# Altium project maxout_conn.PrjPcb
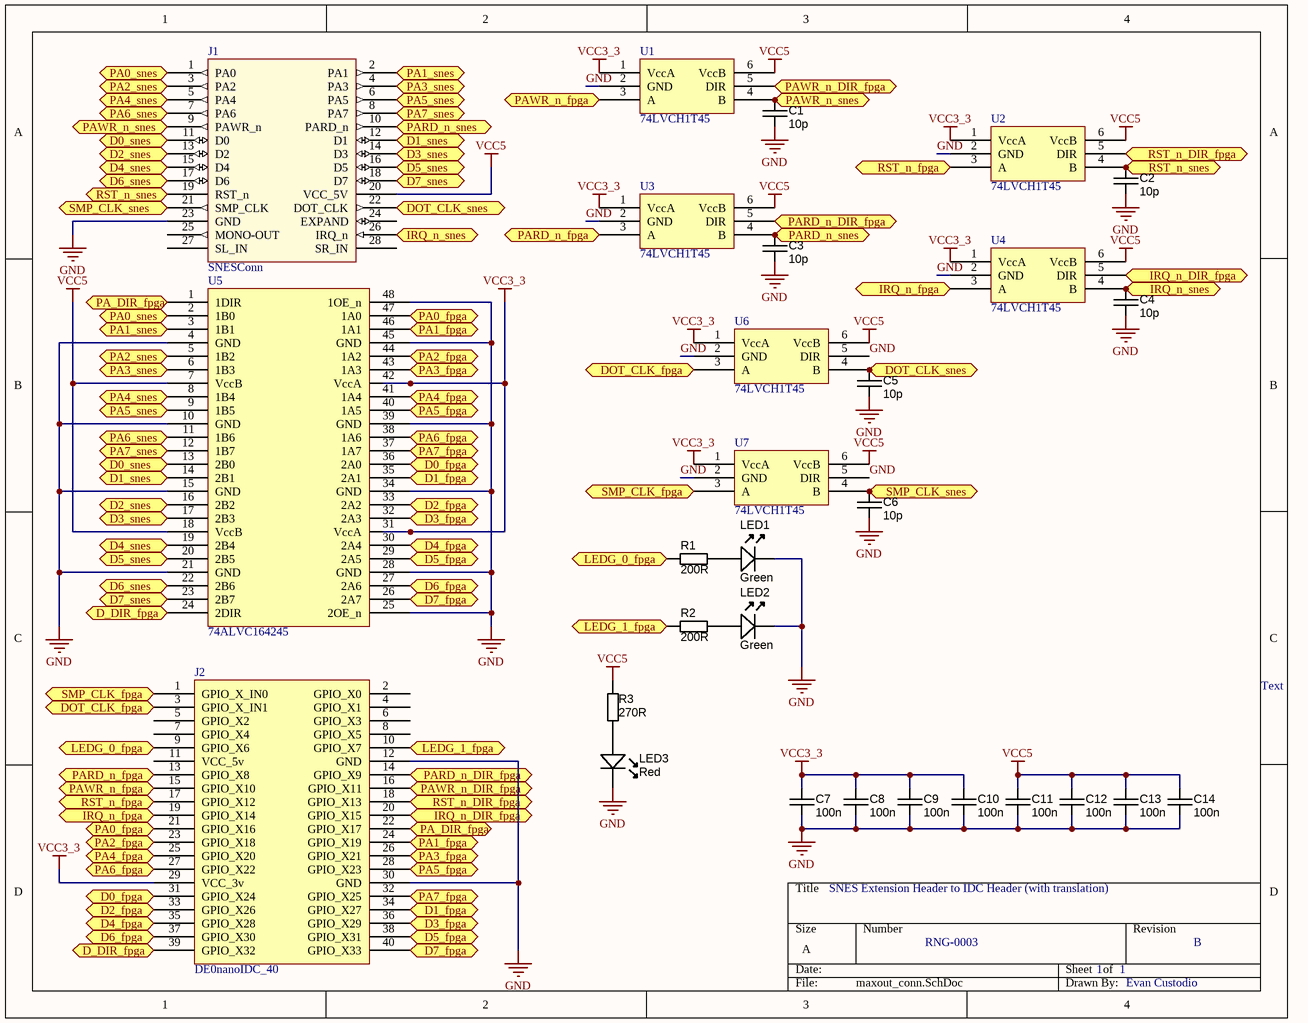
[diagram p0: maxout_conn.SchDoc]
1 sheet, 30 parts. Net scope: flat (ports and power ports of the same name join across sheets).
Board file: maxout_conn.PcbDoc

## Sheet maxout_conn.SchDoc: SNES Extension Header to IDC Header (with translation)
size A; DrawnBy: Evan Custodio; Engineer: Evan Custodio; DocumentNumber: RNG-0003; Revision: B; SheetNumber: 1; SheetTotal: 1

### Parts
?  RNGD_logo  (value not drawn)
C1  10p  [CAPC1608X90N]
C2  10p  [CAPC1608X90N]
C3  10p  [CAPC1608X90N]
C4  10p  [CAPC1608X90N]
C5  10p  [CAPC1608X90N]
C6  10p  [CAPC1608X90N]
C7  value 100n  [CAPC1608X90N]  (hidden comment: approved sub OK)
C8  value 100n  [CAPC1608X90N]  (hidden comment: approved sub OK)
C9  value 100n  [CAPC1608X90N]  (hidden comment: approved sub OK)
C10  value 100n  [CAPC1608X90N]  (hidden comment: approved sub OK)
C11  value 100n  [CAPC1608X90N]  (hidden comment: approved sub OK)
C12  value 100n  [CAPC1608X90N]  (hidden comment: approved sub OK)
C13  value 100n  [CAPC1608X90N]  (hidden comment: approved sub OK)
C14  value 100n  [CAPC1608X90N]  (hidden comment: approved sub OK)
J1  SNESConn  [SNES-MEC2-CONN]
J2  DE0nanoIDC_40  [SNESConnIDC_40]
LED1  Green  [LED-0603-GREEN]
LED2  Green  [LED-0603-GREEN]
LED3  Red  [LED-0603-RED]
R1  value 200R  [RESC1608X55N]  (hidden comment: Thick Film)
R2  value 200R  [RESC1608X55N]  (hidden comment: Thick Film)
R3  value 270R  [RESC1608X55N]  (hidden comment: Thick Film)
U1  74LVCH1T45  [SOT363]
U2  74LVCH1T45  [SOT363]
U3  74LVCH1T45  [SOT363]
U4  74LVCH1T45  [SOT363]
U5  74ALVC164245  [SSOP48]
U6  74LVCH1T45  [SOT363]
U7  74LVCH1T45  [SOT363]

### Ports
D0_fpga, D0_snes, D1_fpga, D1_snes, D2_fpga, D2_snes, D3_fpga, D3_snes, D4_fpga, D4_snes, D5_fpga, D5_snes, D6_fpga, D6_snes, D7_fpga, D7_snes, D_DIR_fpga, DOT_CLK_fpga, DOT_CLK_snes, IRQ_n_DIR_fpga, IRQ_n_fpga, IRQ_n_snes, LEDG_0_fpga, LEDG_1_fpga, PA0_fpga, PA0_snes, PA1_fpga, PA1_snes, PA2_fpga, PA2_snes, PA3_fpga, PA3_snes, PA4_fpga, PA4_snes, PA5_fpga, PA5_snes, PA6_fpga, PA6_snes, PA7_fpga, PA7_snes, PA_DIR_fpga, PARD_n_DIR_fpga, PARD_n_fpga, PARD_n_snes, PAWR_n_DIR_fpga, PAWR_n_fpga, PAWR_n_snes, RST_n_DIR_fpga, RST_n_fpga, RST_n_snes, SMP_CLK_fpga, SMP_CLK_snes

### Nets
GND: C1.2 C2.2 C3.2 C4.2 C5.2 C6.2 C7.2 C8.2 C9.2 C10.2 C11.2 C12.2 C13.2 C14.2 J1.23(GND) J2.12(GND) J2.30(GND) LED1.K LED2.K LED3.K U1.2(GND) U2.2(GND) U3.2(GND) U4.2(GND) U5.4(GND) U5.10(GND) U5.15(GND) U5.21(GND) U5.25(2OE_n) U5.28(GND) U5.34(GND) U5.39(GND) U5.45(GND) U5.48(1OE_n) U6.2(GND) U6.5(DIR) U7.2(GND) U7.5(DIR)
VCC3_3: C7.1 C8.1 C9.1 C10.1 J2.29(VCC_3v) U1.1(VccA) U2.1(VccA) U3.1(VccA) U4.1(VccA) U5.31(VccA) U5.42(VccA) U6.1(VccA) U7.1(VccA)
VCC5: C11.1 C12.1 C13.1 C14.1 J1.20(VCC_5V) R3.1 U1.6(VccB) U2.6(VccB) U3.6(VccB) U4.6(VccB) U5.7(VccB) U5.18(VccB) U6.6(VccB) U7.6(VccB)
NetC1_1: C1.1 J1.9(PAWR_n) U1.4(B) ; port PAWR_n_snes
NetC2_1: C2.1 J1.19(RST_n) U2.4(B) ; port RST_n_snes
NetC3_1: C3.1 J1.10(PARD_n) U3.4(B) ; port PARD_n_snes
NetC4_1: C4.1 J1.26(IRQ_n) U4.4(B) ; port IRQ_n_snes
NetC5_1: C5.1 J1.22(DOT_CLK) U6.4(B) ; port DOT_CLK_snes
NetC6_1: C6.1 J1.21(SMP_CLK) U7.4(B) ; port SMP_CLK_snes
NetJ1_1: J1.1(PA0) U5.2(1B0) ; port PA0_snes
NetJ1_2: J1.2(PA1) U5.3(1B1) ; port PA1_snes
NetJ1_3: J1.3(PA2) U5.5(1B2) ; port PA2_snes
NetJ1_4: J1.4(PA3) U5.6(1B3) ; port PA3_snes
NetJ1_5: J1.5(PA4) U5.8(1B4) ; port PA4_snes
NetJ1_6: J1.6(PA5) U5.9(1B5) ; port PA5_snes
NetJ1_7: J1.7(PA6) U5.11(1B6) ; port PA6_snes
NetJ1_8: J1.8(PA7) U5.12(1B7) ; port PA7_snes
NetJ1_11: J1.11(D0) U5.13(2B0) ; port D0_snes
NetJ1_12: J1.12(D1) U5.14(2B1) ; port D1_snes
NetJ1_13: J1.13(D2) U5.16(2B2) ; port D2_snes
NetJ1_14: J1.14(D3) U5.17(2B3) ; port D3_snes
NetJ1_15: J1.15(D4) U5.19(2B4) ; port D4_snes
NetJ1_16: J1.16(D5) U5.20(2B5) ; port D5_snes
NetJ1_17: J1.17(D6) U5.22(2B6) ; port D6_snes
NetJ1_18: J1.18(D7) U5.23(2B7) ; port D7_snes
NetJ2_1: J2.1(GPIO_X_IN0) U7.3(A) ; port SMP_CLK_fpga
NetJ2_3: J2.3(GPIO_X_IN1) U6.3(A) ; port DOT_CLK_fpga
NetJ2_9: J2.9(GPIO_X6) R1.1 ; port LEDG_0_fpga
NetJ2_10: J2.10(GPIO_X7) R2.1 ; port LEDG_1_fpga
NetJ2_13: J2.13(GPIO_X8) U3.3(A) ; port PARD_n_fpga
NetJ2_14: J2.14(GPIO_X9) U3.5(DIR) ; port PARD_n_DIR_fpga
NetJ2_15: J2.15(GPIO_X10) U1.3(A) ; port PAWR_n_fpga
NetJ2_16: J2.16(GPIO_X11) U1.5(DIR) ; port PAWR_n_DIR_fpga
NetJ2_17: J2.17(GPIO_X12) U2.3(A) ; port RST_n_fpga
NetJ2_18: J2.18(GPIO_X13) U2.5(DIR) ; port RST_n_DIR_fpga
NetJ2_19: J2.19(GPIO_X14) U4.3(A) ; port IRQ_n_fpga
NetJ2_20: J2.20(GPIO_X15) U4.5(DIR) ; port IRQ_n_DIR_fpga
NetJ2_21: J2.21(GPIO_X16) U5.47(1A0) ; port PA0_fpga
NetJ2_22: J2.22(GPIO_X17) U5.1(1DIR) ; port PA_DIR_fpga
NetJ2_23: J2.23(GPIO_X18) U5.44(1A2) ; port PA2_fpga
NetJ2_24: J2.24(GPIO_X19) U5.46(1A1) ; port PA1_fpga
NetJ2_25: J2.25(GPIO_X20) U5.41(1A4) ; port PA4_fpga
NetJ2_26: J2.26(GPIO_X21) U5.43(1A3) ; port PA3_fpga
NetJ2_27: J2.27(GPIO_X22) U5.38(1A6) ; port PA6_fpga
NetJ2_28: J2.28(GPIO_X23) U5.40(1A5) ; port PA5_fpga
NetJ2_31: J2.31(GPIO_X24) U5.36(2A0) ; port D0_fpga
NetJ2_32: J2.32(GPIO_X25) U5.37(1A7) ; port PA7_fpga
NetJ2_33: J2.33(GPIO_X26) U5.33(2A2) ; port D2_fpga
NetJ2_34: J2.34(GPIO_X27) U5.35(2A1) ; port D1_fpga
NetJ2_35: J2.35(GPIO_X28) U5.30(2A4) ; port D4_fpga
NetJ2_36: J2.36(GPIO_X29) U5.32(2A3) ; port D3_fpga
NetJ2_37: J2.37(GPIO_X30) U5.27(2A6) ; port D6_fpga
NetJ2_38: J2.38(GPIO_X31) U5.29(2A5) ; port D5_fpga
NetJ2_39: J2.39(GPIO_X32) U5.24(2DIR) ; port D_DIR_fpga
NetJ2_40: J2.40(GPIO_X33) U5.26(2A7) ; port D7_fpga
NetLED1_A: LED1.A R1.2
NetLED2_A: LED2.A R2.2
NetLED3_A: LED3.A R3.2

Not connected (* = marked no-connect by the designer): J1 24(EXPAND) 25(MONO-OUT) 27(SL_IN) 28(SR_IN); J2 2(GPIO_X0) 4(GPIO_X1) 5(GPIO_X2) 6(GPIO_X3) 7(GPIO_X4) 8(GPIO_X5) 11(VCC_5v)

### Notes on the sheet
- Text

### Library data of the parts
C1-C6 = CAPC_10p_0603_NP0_1%_50V: Capacitor SMD Cer 10pF 5% 50V NP0 0603; Manufacturer 1: Murata Electronics North America; Manufacturer Part Number 1: GRM1885C1H100FA01J; Ratings: 50V; NP0; SCDType: spec; Tolerance: ±5%; Operating Temperature: -55°C ~ 125°C; Package / Case: 0603 (1608 Metric); Size / Dimension: 0.063" L x 0.032" W (1.60mm x 0.81mm); Thickness (Max): 0.035" (0.90mm); Supplier 1: Digi-Key; Supplier Part Number 1: GRM1885C1H100FA01J-ND; Value: 10p
C7-C14 = CAPC_100n_0603_X7R_50V_10%: Capacitor SMD Cer 100nF 10% 50V X7R 0603; Manufacturer 1: AVX Corporation; Manufacturer Part Number 1: 06035C104KAT2A; Ratings: 50V; X7R; Material: ceramic; SCDType: spec; Manufacturer 2: TDK Corporation; Manufacturer Part Number 2: C1608X7R1H104K; Package / Case: 0603 (1608 Metric); Tolerance: ±10%; Supplier 1: Digi-Key; Supplier Part Number 1: 478-5052-1-ND; ComponentLink1URL: http://www.avx.com/docs/Catalogs/cx7r.pdf; ComponentLink1Description: http://www.avx.com/docs/Catalogs/cx7r.pdf; Supplier 2: Digi-Key; Supplier Part Number 2: 445-1314-1-ND; ComponentLink2URL: http://product.tdk.com/capacitor/mlcc/en/documents/mlcc_commercial_general_en.pdf; ComponentLink2Description: http://product.tdk.com/capacitor/mlcc/en/documents/mlcc_commercial_general_en.pdf
LED1 LED2 = LED_SMD_Green_0603_570nm: LED 0603 SMD Green 570nm 50mcd 20mA; Manufacturer 1: Kingbright Company LLC; Manufacturer Part Number 1: APT1608CGCK; Material: AlGaInP; Ratings: 20mcd min; 50 mcd typ; 570 nm; Voltage - Forward (Vf) Typ: 2.1V; Viewing Angle: 120°; Lens Style/Size: Rectangle with Flat Top, 1.1mm x 0.8mm; Voltage - Forward (Vf) @ 10mA: 2.0V; SCDType: source; Wavelength - Peak: 574nm; Lens Type: Clear; Package / Case: 0603 (1608 metric); Color: Green; Current - Test: 20mA; Supplier 1: Digi-Key; Supplier Part Number 1: 754-1116-1-ND; RoHS 1: RoHS Compliant; Wavelength - Dominant: 570nm; ComponentLink1URL: http://www.us.kingbright.com/images/catalog/SPEC/APT1608CGCK.pdf; ComponentLink1Description: http://www.us.kingbright.com/images/catalog/SPEC/APT1608CGCK.pdf
LED3 = LED_SMD_Red_0603_220mcd: LED 0603 SMD Hyper Red 630nm 220mcd 20mA; Manufacturer 1: Kingbright Company LLC; Manufacturer Part Number 1: APT1608SURCK; Material: AlGaInP on GaAs; Ratings: 220 mcd; 630 nm; Voltage - Forward (Vf) Typ: 1.95V; Voltage - Forward (Vf) @ 10mA: 1.9V; SCDType: source; Package / Case: 0603 (1608 metric); Supplier 1: Digi-Key; Supplier Part Number 1: 754-1123-1-ND; ComponentLink1URL: http://www.us.kingbright.com/images/catalog/SPEC/APT1608SURCK.pdf; ComponentLink1Description: http://www.us.kingbright.com/images/catalog/SPEC/APT1608SURCK.pdf
R1 R2 = RES_200R_0603_5%: Resistor SMD chip 200 Ohm 0.1W 5% 0603; Manufacturer 1: Yageo; Manufacturer Part Number 1: RC0603JR-07200RL; Ratings: 1/10 W; SCDType: undef; Package / Case: 0603 (1608 metric); Tolerance: ±5%; Material: Thick Film; Supplier 1: Digi-Key; Supplier Part Number 1: 311-200GRCT-ND
R3 = RES_270R_0603_5%: Resistor SMD chip 270 Ohm 0.1W 5% 0603; Manufacturer 1: Yageo; Manufacturer Part Number 1: RC0603JR-07270RL; Ratings: 1/10 W; SCDType: undef; Package / Case: 0603 (1608 metric); Tolerance: ±5%; Material: Thick Film; Supplier 1: Digi-Key; Supplier Part Number 1: 311-270GRCT-ND
U1-U4 U6 U7 = 74AVCH1T45: Dual-supply voltage level translator/transceiver; 3-state
U5 = 74ALVC164245: 16-bit dual supply translating transceiver; 3-state